# Altium project DE-151116.PrjPcb
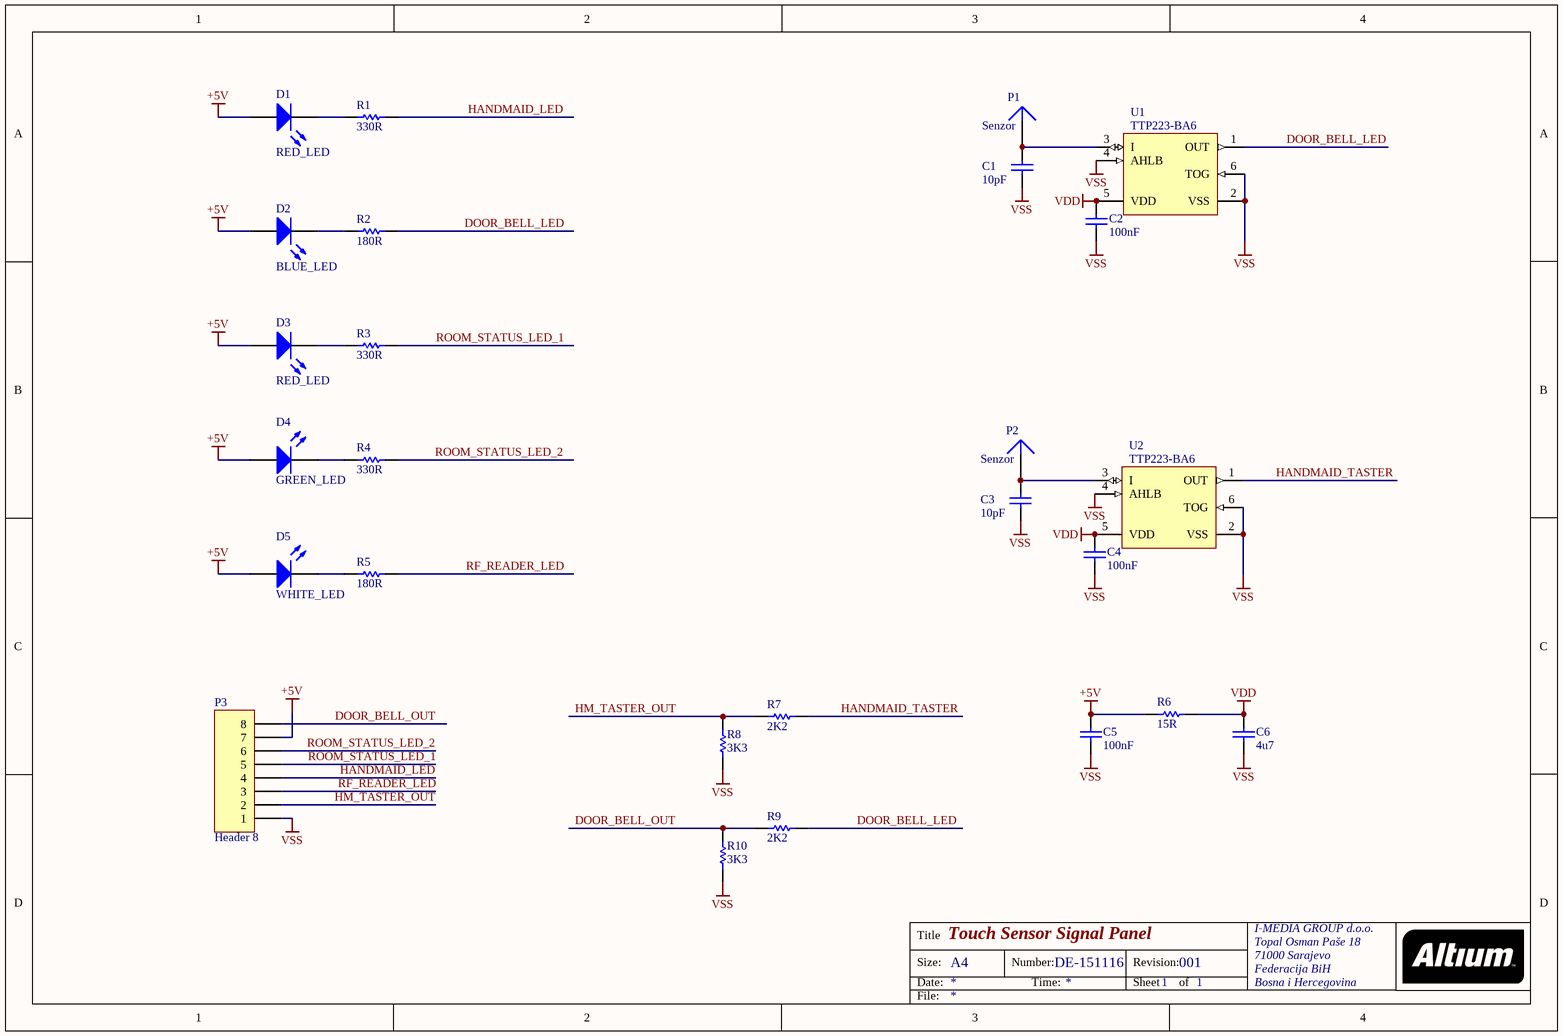
[diagram p0: DE-151116.SchDoc]
1 sheet, 26 parts. Net scope: global (net labels, ports and power ports of the same name join across sheets).
Board file: DE-151116.PcbDoc

## Sheet DE-151116.SchDoc: Touch Sensor Signal Panel
size A4; Author: eldar6776@hotmail.com; DrawnBy: Eldar Dedic; Organization: I-MEDIA GROUP d.o.o.; Address1: Topal Osman Paše 18; Address2: 71000 Sarajevo; Address3: Federacija BiH; Address4: Bosna i Hercegovina; DocumentNumber: DE-151116; Revision: 001; SheetNumber: 1; SheetTotal: 1; DocumentName: DE-151116; ProjectName: DE-151116

### Parts
C1  10pF  [0603]
C2  100nF  [0603]
C3  10pF  [0603]
C4  100nF  [0603]
C5  100nF  [0603]
C6  4u7  [0805]
D1  RED_LED  [1.6X0.8X0.8]
D2  BLUE_LED  [1.6X0.8X0.8]
D3  RED_LED  [1.6X0.8X0.8]
D4  GREEN_LED  [1.6X0.8X0.8]
D5  WHITE_LED  [1.6X0.8X0.8]
P1  Senzor  [PIN1]
P2  Senzor  [PIN1]
P3  Header 8  [HDR1X8]
R1  330R  [ERA-0603]
R2  180R  [ERA-0603]
R3  330R  [ERA-0603]
R4  330R  [ERA-0603]
R5  180R  [ERA-0603]
R6  15R  [ERA-0805]
R7  2K2  [ERA-0603]
R8  3K3  [ERA-0603]
R9  2K2  [ERA-0603]
R10  3K3  [ERA-0603]
U1  TTP223-BA6  [6ST1_N]
U2  TTP223-BA6  [6ST1_N]

### Nets
+5V: C5.2 D1.1(A) D2.1(A) D3.1(A) D4.1(A) D5.1(A) P3.7 R6.1
VDD: C2.2 C4.2 C6.2 R6.2 U1.5(VDD) U2.5(VDD)
VSS: C1.2 C2.1 C3.2 C4.1 C5.1 C6.1 P3.1 R8.2 R10.2 U1.2(VSS) U1.4(AHLB) U1.6(TOG) U2.2(VSS) U2.4(AHLB) U2.6(TOG)
DOOR_BELL_LED: R2.1 R9.1 U1.1(OUT)
DOOR_BELL_OUT: P3.8 R9.2 R10.1
HANDMAID_LED: P3.4 R1.1
HANDMAID_TASTER: R7.1 U2.1(OUT)
HM_TASTER_OUT: P3.2 R7.2 R8.1
RF_READER_LED: P3.3 R5.1
ROOM_STATUS_LED_1: P3.5 R3.1
ROOM_STATUS_LED_2: P3.6 R4.1
NetC1_1: C1.1 P1.1 U1.3(I)
NetC3_1: C3.1 P2.1 U2.3(I)
NetD1_2: D1.2(K) R1.2
NetD2_2: D2.2(K) R2.2
NetD3_2: D3.2(K) R3.2
NetD4_2: D4.2(K) R4.2
NetD5_2: D5.2(K) R5.2

### Notes on the sheet
- Title
- Size:
- Date:
- A4
- Number:
- Time:
- Revision:
- Sheet
- of
- File:

### Library data of the parts
C1-C5 = C0603: Ceramic Chip Capacitor - Standard; Note: Footprint corresponds to dimensions for bulk cassette packaging. This case size has tightened tolerances.; Published: 17-Jul-2002; LatestRevisionDate: 19-Mar-2004; LatestRevisionNote: Silkscreen size reduced.; DatasheetDocument: Mar-2001; PackageDocument: Mar-2001; PackageReference: 0603; Publisher: Altium Limited; Code_JEITA: 0603; Code_IPC: 1608 [0603]; ComponentLink1Description: Manufacturer Link; ComponentLink1URL: http://www.kemet.com/; ComponentLink2Description: Datasheet; ComponentLink2URL: http://www.kemet.com/kemet/web/homepage/kechome.nsf/vapubfilesname/F3102TA.pdf/$file/F3102TA.pdf
  C1 C3: Value: 10pF
  C2 C4 C5: Value: 100nF
C6 = C0805: Ceramic Chip Capacitor - Standard; Note: Footprint corresponds to dimensions for bulk cassette packaging. This case size has tightened tolerances.; Published: 17-Jul-2002; LatestRevisionDate: 19-Mar-2004; LatestRevisionNote: Silkscreen size reduced.; DatasheetDocument: Mar-2001; PackageDocument: Mar-2001; PackageReference: 0805; Publisher: Altium Limited; Code_JEITA: 0805; Code_IPC: 2012[0805]; ComponentLink1Description: Manufacturer Link; ComponentLink1URL: http://www.kemet.com/; ComponentLink2Description: Datasheet; ComponentLink2URL: http://www.kemet.com/kemet/web/homepage/kechome.nsf/vapubfilesname/F3102TA.pdf/$file/F3102TA.pdf; Value: 4u7
D1 D3 = HSMC-C190: High Performance Chip LED, Red; LuminousIntensity: 25mcd (Minimum).; PCB_Layout: Complies with manufacturer's recommendation.; Published: 11-Dec-2002; DatasheetDocument: 11-Mar-2002; PackageDocument: 11-Mar-2002; PackageReference: 1.6X0.8X0.8; Publisher: Altium Limited; LED_Colour: Red; ComponentLink1Description: Manufacturer Link; ComponentLink1URL: http://www.agilent.com/; ComponentLink2Description: Datasheet; ComponentLink2URL: http://cp.literature.agilent.com/litweb/pdf/5988-5891EN.pdf
D2 = HSMB-C190: Blue Surface Mount Chip LED, Blue; LuminousIntensity: 1.6mcd (Minimum).; PCB_Layout: Complies with manufacturer's recommendation.; Published: 11-Dec-2002; DatasheetDocument: 26-Feb-2002; PackageDocument: 11-Mar-2002; PackageReference: 1.6X0.8X0.8; Publisher: Altium Limited; LED_Colour: Blue; ComponentLink1Description: Manufacturer Link; ComponentLink1URL: http://www.agilent.com/; ComponentLink2Description: Datasheet; ComponentLink2URL: http://cp.literature.agilent.com/litweb/pdf/5988-5211EN.pdf
D4 = HSMM-C190: High Performance SMT Chip LED, Green; LuminousIntensity: 40mcd (Minimum).; PCB_Layout: Complies with manufacturer's recommendation.; Published: 11-Dec-2002; DatasheetDocument: 11-Mar-2002; PackageDocument: 11-Mar-2002; PackageReference: 1.6X0.8X0.8; Publisher: Altium Limited; LED_Colour: Green; ComponentLink1Description: Manufacturer Link; ComponentLink1URL: http://www.agilent.com/; ComponentLink2Description: Datasheet; ComponentLink2URL: http://cp.literature.agilent.com/litweb/pdf/5988-5213EN.pdf
D5 = HSMA-C190: High Performance Chip LED, Amber; LuminousIntensity: 25mcd (Minimum).; PCB_Layout: Complies with manufacturer's recommendation.; Published: 11-Dec-2002; DatasheetDocument: 11-Mar-2002; PackageDocument: 11-Mar-2002; PackageReference: 1.6X0.8X0.8; Publisher: Altium Limited; LED_Colour: Amber; ComponentLink1Description: Manufacturer Link; ComponentLink1URL: http://www.agilent.com/; ComponentLink2Description: Datasheet; ComponentLink2URL: http://cp.literature.agilent.com/litweb/pdf/5988-5891EN.pdf
P1 P2 = Plug: LatestRevisionDate: 17-Jul-2002; LatestRevisionNote: Re-released for DXP Platform.; Publisher: Altium Limited
P3 = Header 8: Header, 8-Pin; LatestRevisionDate: 17-Jul-2002; LatestRevisionNote: Re-released for DXP Platform.; Publisher: Altium Limited
R1-R5 R7-R10 = ERAV: Metal Film Thermosensitive Chip Resistor, 0.56 Ohm to 10k Ohm Range, 5% Tolerance, 0603 Size, 0.063 W; Note: If flow soldering, adjust pad width of PCB Footprint to 0.7 - 0.8 times the width of the resistor.; Published: 17-Dec-2003; LatestRevisionDate: 19-Mar-2004; LatestRevisionNote: Silkscreen size reduced.; PackageDocument: Mar-2003; PackageReference: ERA-0603; Publisher: Altium Limited; Code_IPC: 1608 [0603]; ComponentLink1Description: Manufacturer Link; ComponentLink1URL: http://www.panasonic.com/industrial/components/resistive_products.htm; ComponentLink2Description: Datasheet; ComponentLink2URL: http://www.panasonic.com/industrial/components/pdf/AOF0000CE1.pdf
R6 = ERA6Y: Rectangular Thick Film Chip Resistor, 10 Ohm to 1M Ohm Range, 0.1% and 0.5% Tolerance, 0805 Size, 0.1 W; Note: If flow soldering, adjust pad width of PCB Footprint to 0.7 - 0.8 times the width of the resistor.; Published: 17-Dec-2003; LatestRevisionDate: 19-Mar-2004; LatestRevisionNote: Silkscreen size reduced.; PackageDocument: Mar-2003; PackageReference: ERA-0805; Publisher: Altium Limited; Code_IPC: 2012 [0805]; ComponentLink1Description: Manufacturer Link; ComponentLink1URL: http://www.panasonic.com/industrial/components/resistive_products.htm; ComponentLink2Description: Datasheet; ComponentLink2URL: http://www.panasonic.com/industrial/components/pdf/AOA0000CE8.pdf
U1 U2 = AT42QT1012: One-channel Toggle-mode Touch Sensor IC with Power Management Functions, 6-pin SOT23; Published: 1-Apr-2010; DatasheetVersion: revCS, Feb-2010; PackageVersion: revA, Jun-2008; PackageReference: 6ST1; Publisher: Altium Limited; PackageDescription: 6-Lead, 2.90 x 1.60 mm Plastic Small Outline Package (SOT23); Code_JEDEC: MO-178-AB; Code_IPC: SOT26A-6; ComponentLink1Description: Manufacturer Link; ComponentLink1URL: http://www.atmel.com/products/overview_touch.asp?; ComponentLink2Description: AT42QT1012 Summary; ComponentLink2URL: http://www.atmel.com/dyn/resources/prod_documents/9543S.pdf; ComponentLink3Description: Atmel.com Home; ComponentLink3URL: http://www.atmel.com